# Altium schematic sheet Switch.SchDoc
size A4
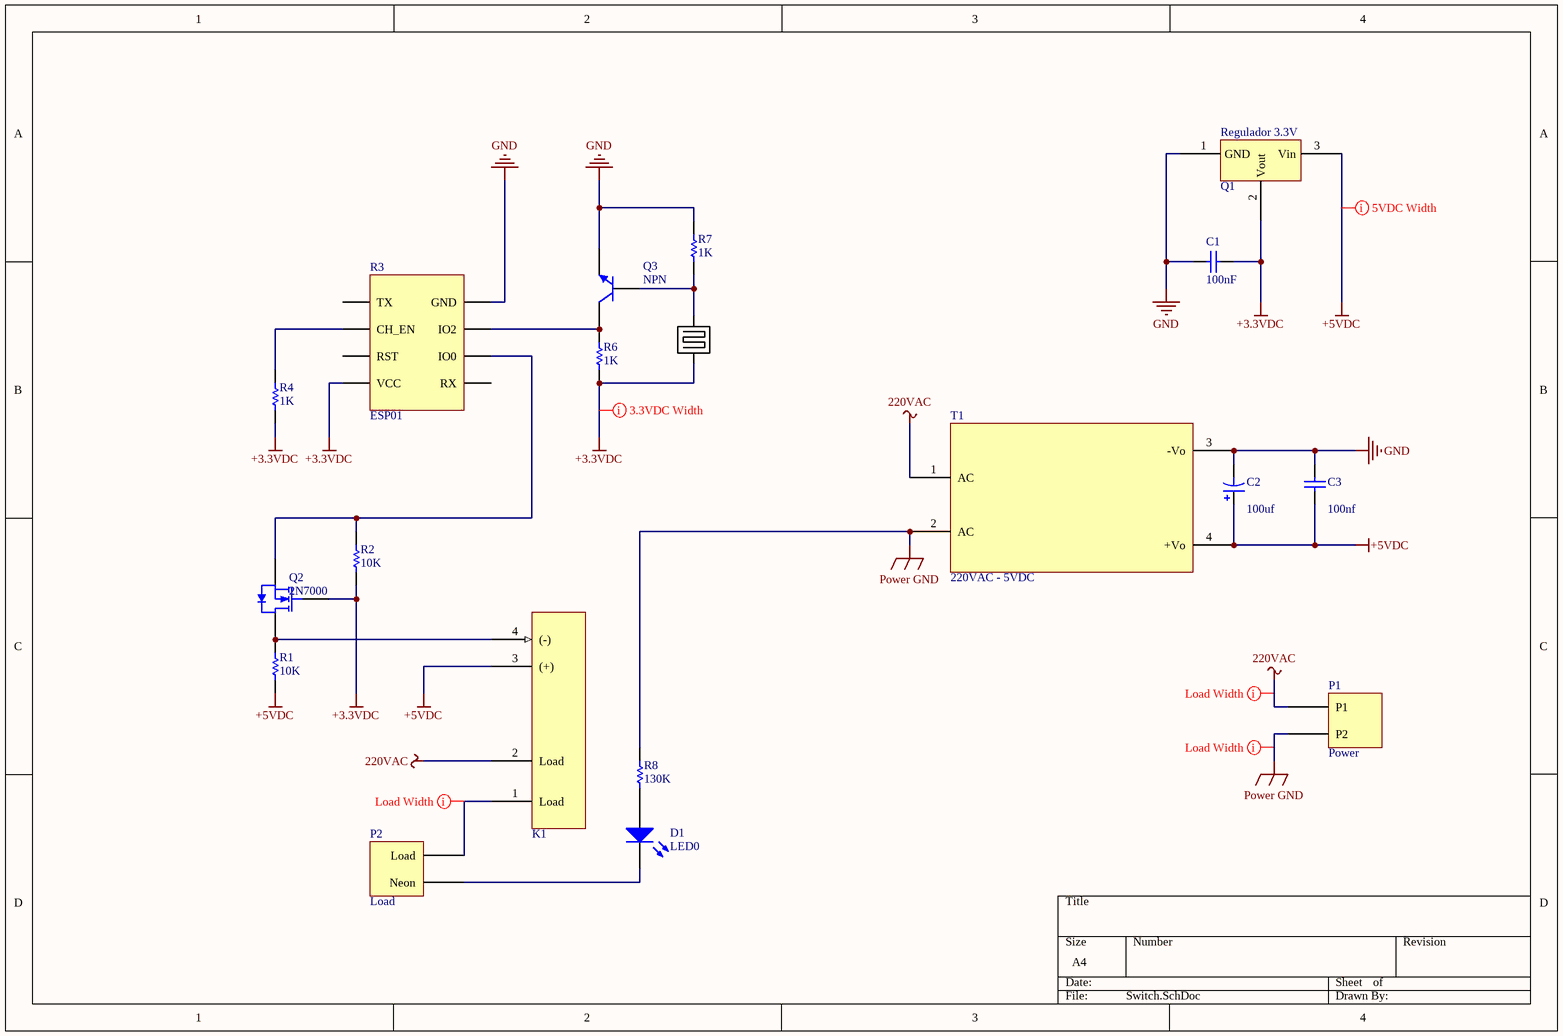
[diagram p0: Switch.SchDoc]

## Parts
C1  100nf  [RAD-0.1]
C2  value 100uf  [RAD-0.1]  (hidden comment: Cap Pol1)
C3  value 100nf  [RAD-0.1]  (hidden comment: Cap)
D1  LED0  [RAD-0.1]
K1  G3MB-202P DC5  [G3MB-202P DC5]  (value not drawn)
P1  Power  [ScrewTerminal-X2]
P2  Load  [ScrewTerminal-X2]
Q1  Regulador 3.3V  [TO-220-AB]
Q2  2N7000  [SOT54]
Q3  NPN  [TO-92]
R1  10K  [AXIAL-0.3]
R2  10K  [AXIAL-0.3]
R3  ESP01  [HDR2X4]
R4  value 1K  [AXIAL-0.3]  (hidden comment: 10K)
R5  LDR  [RAD-0.1]  (value not drawn)
R6  value 1K  [AXIAL-0.3]  (hidden comment: 10K)
R7  value 1K  [AXIAL-0.3]  (hidden comment: 10K)
R8  value 130K  [AXIAL-0.3]  (hidden comment: 10K)
T1  220VAC - 5VDC  [HLK-PM]

## Nets
220VAC: K1.2(Load) P1.1(P1) T1.1(AC)
+3.3VDC: C1.2 Q1.2(Vout) Q2.2(G) R2.2 R3.4(VCC) R4.2 R5.2 R6.2
+5VDC: C2.1 C3.1 K1.3((+)) Q1.3(Vin) R1.2 T1.4(+Vo)
GND: C1.1 C2.2 C3.2 Q1.1(GND) Q3.3(E) R3.5(GND) R7.2 T1.3(-Vo)
Power GND: P1.2(P2) R8.2 T1.2(AC)
NetD1_1: D1.1(A) R8.1
NetD1_2: D1.2(K) P2.1(Neon)
NetK1_1: K1.1(Load) P2.2(Load)
NetK1_4: K1.4((-)) Q2.1(D) R1.1
NetQ2_3: Q2.3(S) R2.1 R3.7(IO0)
NetQ3_1: Q3.1(C) R3.6(IO2) R6.1
NetQ3_2: Q3.2(B) R5.1 R7.1
NetR3_2: R3.2(CH_EN) R4.1

Not connected (* = marked no-connect by the designer): R3 1(TX) 3(RST) 8(RX)

## Layout directives
rule Width Constraint [Pref Width = 90mil    Min Width = 60mil    Max Width = 100mil]: 220VAC, NetK1_1, Power GND
rule Width Constraint [Pref Width = 25mil    Min Width = 15mil    Max Width = 30mil]: +3.3VDC, +5VDC

## Library data of the parts
C1 C3 = Cap: Capacitor; Published: 8-Jun-2000; LatestRevisionDate: 17-Jul-2002; LatestRevisionNote: Re-released for DXP Platform.; PackageReference: RAD-0.3; Publisher: Altium Limited; PackageDescription: Radial Cap, Thru-Hole; 2 Leads; 0.3 in Pin Spacing
  C1: Value: 100nF
C2 = Cap Pol1: Polarized Capacitor (Radial); Published: 8-Jun-2000; LatestRevisionDate: 17-Jul-2002; LatestRevisionNote: Re-released for DXP Platform.; PackageReference: RB7.6-15; Publisher: Altium Limited; PackageDescription: Polarized Capacitor (Radial); 2 Leads
D1 = LED0: Typical INFRARED GaAs LED; Published: 8-Jun-2000; LatestRevisionDate: 08-Jul-2005; LatestRevisionNote: Mech Layer 1 removed.; PackageReference: LED-0; Publisher: Altium Limited; PackageDescription: LED; 2 Leads
K1 = G3MB-202P DC5: RELAY MINI SSR 240VAC@2A ZERO; Mfr: Omron; Mfr PN: G3MB-202P DC5
P1 P2 = ScrewTerminal
Q1 = AMS1117
Q2 = 2N7000: N-channel Enhancement Mode Field-effect Transistor; Published: 17-Sep-2003; LatestRevisionDate: 12-Dec-2006; LatestRevisionNote: Footprint pad sequence fixed.; DatasheetVersion: 19-May-2000; PackageVersion: Feb-1997; PackageReference: SOT54; Publisher: Altium Limited; PackageDescription: Plastic Single-Ended Leaded (through hole) package; 3 Leads (TO-92); Code_JEITA: SC-43; Code_JEDEC: TO-92; ComponentLink1Description: Manufacturer Link; ComponentLink1URL: http://www.semiconductors.philips.com/; ComponentLink2Description: Datasheet; ComponentLink2URL: http://www.semiconductors.philips.com/acrobat/datasheets/2N7000-03.pdf
Q3 = NPN: NPN Bipolar Transistor; Published: 8-Jun-2000; LatestRevisionDate: 17-Jul-2002; LatestRevisionNote: Re-released for DXP Platform.; PackageReference: TO-226-AA; Publisher: Altium Limited; PackageDescription: TO, Flat Index; 3 In-Line, Axial Leads; Body Dia. 4.8mm; Leads 0.55 x 0.51 mm (max); Code_JEDEC: TO-226-AA
R1 R2 R4 R6-R8 = Res1: Resistor; Published: 8-Jun-2000; LatestRevisionDate: 17-Jul-2002; LatestRevisionNote: Re-released for DXP Platform.; PackageReference: AXIAL-0.3; Publisher: Altium Limited; PackageDescription: Axial Device, Thru-Hole; 2 Leads; 0.3 in Pin Spacing
  R1 R2: Value: 10K
R3 = ESP01: pin to pad: 1>8 2>6 3>4 4>2 5>7 6>5 7>3 8>1
T1 = HLK-PM: HLK-PM*; Mfr: HLK-PM01